# EasyEDA Pro project ProPrj_chuni_24_2026-08-18.epro

# Schematic Schematic1
Assembly Variant: Basic; Board Name: Board1; Create Date: 2026-08-10; Page Name: P1; Project Name: chuni_24; Schematic Name: Schematic1; Update Date: 2026-08-10; Company: 嘉立创EDA; Page Size: A4; Version: V1.0
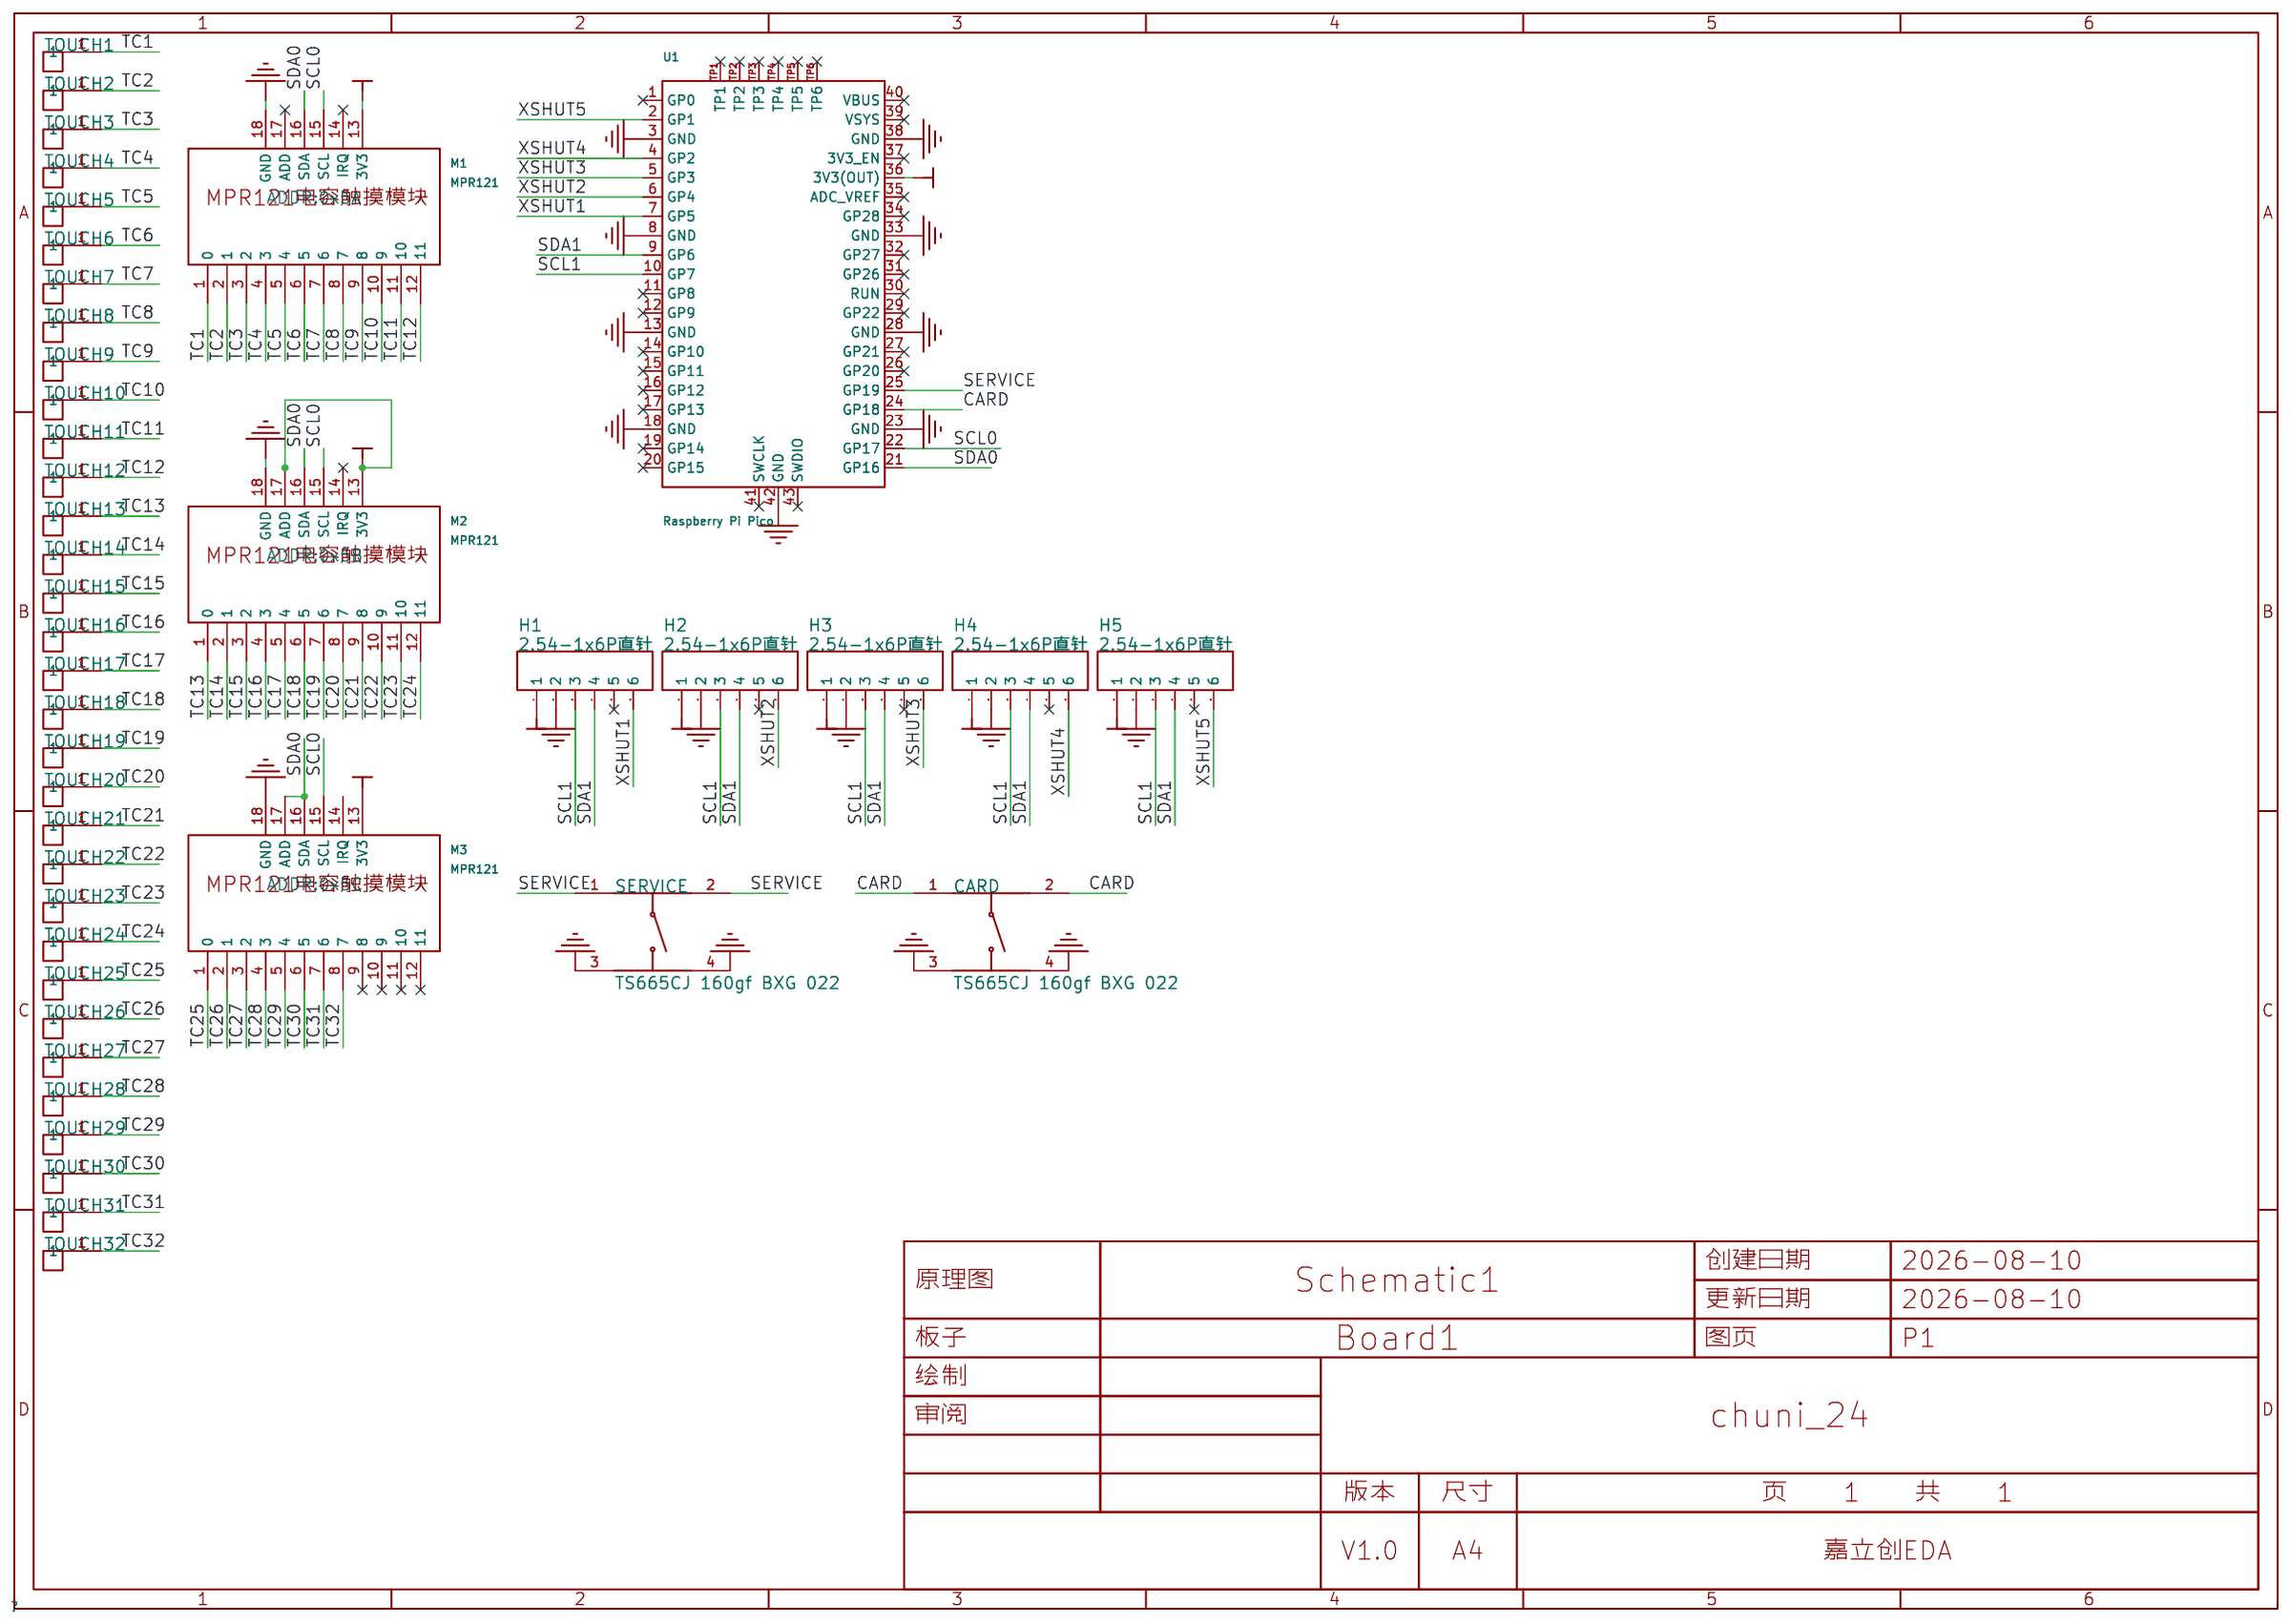
[diagram p0: schematic sheet]

## Parts
CARD  TS665CJ 160gf BXG 022  [SW-TH_4P-L6.0-W6.0-P4.50-LS6.5]
H1  2.54-1x6P直针  [HDR-TH_6P-P2.54-V-M-1]
H2  2.54-1x6P直针  [HDR-TH_6P-P2.54-V-M-1]
H3  2.54-1x6P直针  [HDR-TH_6P-P2.54-V-M-1]
H4  2.54-1x6P直针  [HDR-TH_6P-P2.54-V-M-1]
H5  2.54-1x6P直针  [HDR-TH_6P-P2.54-V-M-1]
M1  MPR121  [MPR121]
M2  MPR121  [MPR121]
M3  MPR121  [MPR121]
SERVICE  TS665CJ 160gf BXG 022  [SW-TH_4P-L6.0-W6.0-P4.50-LS6.5]
TOUCH1  -  [touch_24.5]
TOUCH2  -  [touch_24.5]
TOUCH3  -  [touch_24.5]
TOUCH4  -  [touch_24.5]
TOUCH5  -  [touch_24.5]
TOUCH6  -  [touch_24.5]
TOUCH7  -  [touch_24.5]
TOUCH8  -  [touch_24.5]
TOUCH9  -  [touch_24.5]
TOUCH10  -  [touch_24.5]
TOUCH11  -  [touch_24.5]
TOUCH12  -  [touch_24.5]
TOUCH13  -  [touch_24.5]
TOUCH14  -  [touch_24.5]
TOUCH15  -  [touch_24.5]
TOUCH16  -  [touch_24.5]
TOUCH17  -  [touch_24.5]
TOUCH18  -  [touch_24.5]
TOUCH19  -  [touch_24.5]
TOUCH20  -  [touch_24.5]
TOUCH21  -  [touch_24.5]
TOUCH22  -  [touch_24.5]
TOUCH23  -  [touch_24.5]
TOUCH24  -  [touch_24.5]
TOUCH25  -  [touch_24.5]
TOUCH26  -  [touch_24.5]
TOUCH27  -  [touch_24.5]
TOUCH28  -  [touch_24.5]
TOUCH29  -  [touch_24.5]
TOUCH30  -  [touch_24.5]
TOUCH31  -  [touch_24.5]
TOUCH32  -  [touch_24.5]
U1  Raspberry Pi Pico  [COMM-SMD_L51.0-W21.0-P2.54_SC0916]

## Library data of the parts
CARD SERVICE = TS665CJ 160gf BXG 022: 电路结构:单刀单掷;按钮形状:圆形按钮;作用力:1.6N;安装方式:直插;开关长度:6mm;开关宽度:6mm;开关高度:5mm;带支架:不带支架;触点电流:50mA;额定电压:12V;带灯:无;工作寿命:10万次;; LCSC Part Name: 四脚插件立式 6*6*5mm 不锈钢弹片 160gf; Supplier Part: C5369132; Manufacturer: SHOU HAN(首韩); Supplier Footprint: 插件-4P,6x6mm; JLCPCB Part Class: Extended Part; Datasheet: https://item.szlcsc.com/datasheet/TS665CJ%2520160gf%2520BXG%2520022/6210558.html; Supplier: LCSC; Circuit: 单刀单掷; Actuator Style: 圆形按钮; Operating Force: 1.6N; Mounting Type: 直插; Length: 6mm; Width: 6mm; Switch Height: 5mm; with Bracket: 不带支架; Contact Current: 50mA; Voltage Rating: 12V; Actuator/Cap Color: 黑色; With Lamp: 无; Termination Style: PC引脚; Life: 10万次; Operating Temperature: -16℃~+60℃
H1-H5 = 2.54-1x6P直针: 插针结构:1x6P;间距:2.54mm;行距:-;圆针/方针:方针;安装方式:直插;排数:单排;总PIN位数:6P;额定电流:3A;额定电压:-;配合针长度:6mm;塑高:2.5mm;端接针长度:3mm;触头材质:黄铜;触头镀层:金;工作温度:-40℃~+105℃;颜色:黑色;; LCSC Part Name: 1x6P 间距:2.54mm 方针 直插; Supplier Part: C37208; Manufacturer: BOOMELE(博穆精密); Supplier Footprint: 插件,P=2.54mm; JLCPCB Part Class: Extended Part; Datasheet: https://item.szlcsc.com/datasheet/2.54-1x6P%25E7%259B%25B4%25E9%2592%2588/38187.html; Supplier: LCSC; Pin Structure: 1x6P; Pitch: 2.54mm; Circluar Pins/Square Pins: 方针; Mounting Type: 直插; Number of Rows: 单排; Number of Pins: 6P; Current Rating: 3A; Length of Mating Pin: 6mm; Insulation Height: 2.5mm; Length of End Connection Pin: 3mm; Contact Material: 黄铜; Contact Plating: 金; Operating Temperature: -40℃~+105℃; Color: 黑色
M1-M3 = MPR121
TOUCH1-TOUCH32 = touch_24.5
U1 = Raspberry Pi Pico: "基于Raspberry Pi RP2040芯片设计；处理器：双核Arm Cortex-M0+ @ 133MHz内存：264KB片上SRAM；2MB板上QSPI闪存接口：26个GPIO引脚，包括3个模拟输入；2 × UART；2 × SPI控制器；2 × I2C控制器；16个PWM通道；1 × USB 1.1控制器和PHY，支持主机和设备；8 × PIO状态机"; LCSC Part Name: SC0915; Supplier Part: C7203002; Manufacturer: Raspberry Pi(树莓派); JLCPCB Part Class: Extended Part; Datasheet: https://item.szlcsc.com/datasheet/Raspberry%2520Pi%2520Pico/8170960.html; Supplier: LCSC

## Nets
GND: CARD.3(C) CARD.4(D) H1.2 H2.2 H3.2 H4.2 H5.2 M1.18(GND) M2.18(GND) M3.18(GND) SERVICE.3(C) SERVICE.4(D) U1.3(GND) U1.8(GND) U1.13(GND) U1.18(GND) U1.23(GND) U1.28(GND) U1.33(GND) U1.38(GND) U1.42(GND)
VCC: H1.1 H2.1 H3.1 H4.1 H5.1 M1.13(3V3) M2.13(3V3) M2.17(ADD) M3.13(3V3) U1.36(3V3(OUT))
CARD: CARD.1(A) CARD.2(B) U1.24(GP18)
SCL0: M1.15(SCL) M2.15(SCL) M3.15(SCL) U1.22(GP17)
SCL1: H1.3 H2.3 H3.3 H4.3 H5.3 U1.10(GP7)
SDA0: M1.16(SDA) M2.16(SDA) M3.16(SDA) M3.17(ADD) U1.21(GP16)
SDA1: H1.4 H2.4 H3.4 H4.4 H5.4 U1.9(GP6)
SERVICE: SERVICE.1(A) SERVICE.2(B) U1.25(GP19)
TC1: M1.1(0) TOUCH1.1
TC2: M1.2(1) TOUCH2.1
TC3: M1.3(2) TOUCH3.1
TC4: M1.4(3) TOUCH4.1
TC5: M1.5(4) TOUCH5.1
TC6: M1.6(5) TOUCH6.1
TC7: M1.7(6) TOUCH7.1
TC8: M1.8(7) TOUCH8.1
TC9: M1.9(8) TOUCH9.1
TC10: M1.10(9) TOUCH10.1
TC11: M1.11(10) TOUCH11.1
TC12: M1.12(11) TOUCH12.1
TC13: M2.1(0) TOUCH13.1
TC14: M2.2(1) TOUCH14.1
TC15: M2.3(2) TOUCH15.1
TC16: M2.4(3) TOUCH16.1
TC17: M2.5(4) TOUCH17.1
TC18: M2.6(5) TOUCH18.1
TC19: M2.7(6) TOUCH19.1
TC20: M2.8(7) TOUCH20.1
TC21: M2.9(8) TOUCH21.1
TC22: M2.10(9) TOUCH22.1
TC23: M2.11(10) TOUCH23.1
TC24: M2.12(11) TOUCH24.1
TC25: M3.1(0) TOUCH25.1
TC26: M3.2(1) TOUCH26.1
TC27: M3.3(2) TOUCH27.1
TC28: M3.4(3) TOUCH28.1
TC29: M3.5(4) TOUCH29.1
TC30: M3.6(5) TOUCH30.1
TC31: M3.7(6) TOUCH31.1
TC32: M3.8(7) TOUCH32.1
XSHUT1: H1.6 U1.7(GP5)
XSHUT2: H2.6 U1.6(GP4)
XSHUT3: H3.6 U1.5(GP3)
XSHUT4: H4.6 U1.4(GP2)
XSHUT5: H5.6 U1.2(GP1)

Not connected (* = marked no-connect by the designer): H1 5*; H2 5*; H3 5*; H4 5*; H5 5*; M1 14(IRQ)* 17(ADD)*; M2 14(IRQ)*; M3 9(8)* 10(9)* 11(10)* 12(11)* 14(IRQ); U1 1(GP0)* 11(GP8)* 12(GP9)* 14(GP10)* 15(GP11)* 16(GP12)* 17(GP13)* 19(GP14)* 20(GP15)* 26(GP20)* 27(GP21)* 29(GP22)* 30(RUN)* 31(GP26)* 32(GP27)* 34(GP28)* 35(ADC_VREF)* 37(3V3_EN)* 39(VSYS)* 40(VBUS)* 41(SWCLK)* 43(SWDIO)* TP1* TP2* TP3* TP4* TP5* TP6*

## Notes on the sheet
- ADDR:0x5A
- ADDR:0x5B
- ADDR:0x5C

# Board PCB1
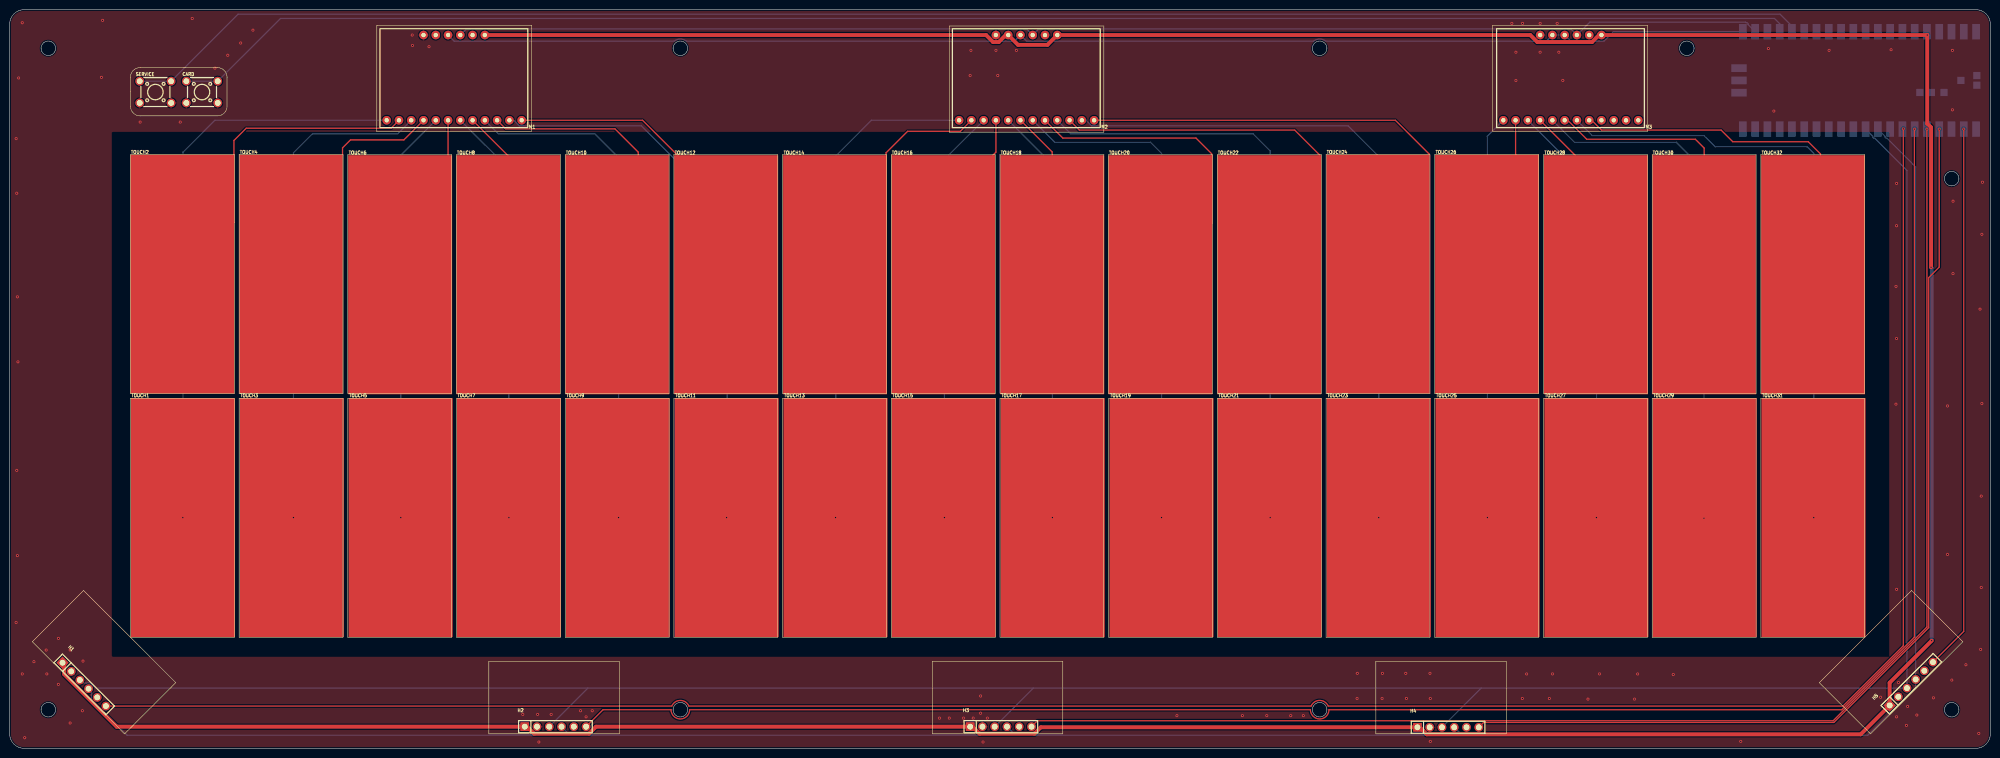
[diagram p1: board, top side]
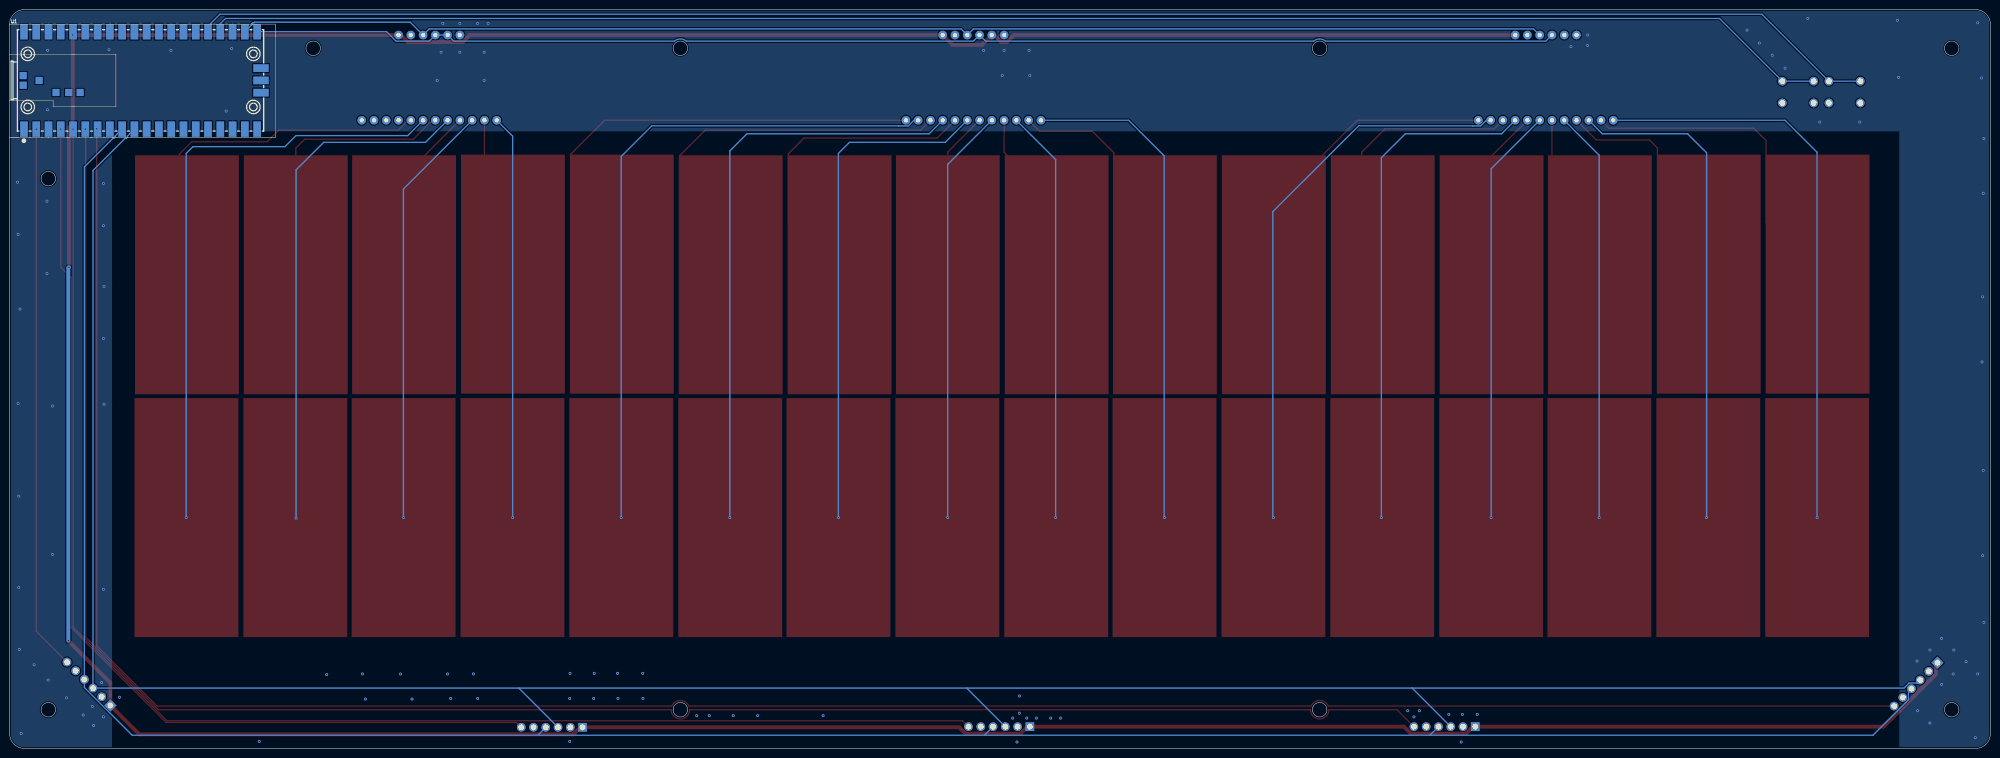
[diagram p2: board, bottom side, seen from below]

Outline 410 x 153 mm; copper layers: Top Layer, Bottom Layer. Coordinates in mm from the lower left corner of the outline.
Outline path: 0,150 arc(0.88,152.12) 3,153 407,153 arc(409.12,152.12) 410,150 410,3 arc(409.12,0.88) 407,0 3,0 arc(0.88,0.88) 0,3 0,150 ; 6.5,145 arc(8,146.5) 9.5,145 arc(8,143.5) 6.5,145 ; 6.5,8 arc(8,9.5) 9.5,8 arc(8,6.5) 6.5,8 ; 137.33,145 arc(138.83,146.5) 140.33,145 arc(138.83,143.5) 137.33,145 ; 137.33,8 arc(138.83,9.5) 140.33,8 arc(138.83,6.5) 137.33,8 ; 269.67,145 arc(271.17,146.5) 272.67,145 arc(271.17,143.5) 269.67,145 ; 269.67,8 arc(271.17,9.5) 272.67,8 arc(271.17,6.5) 269.67,8 ; 345.67,145 arc(347.17,146.5) 348.67,145 arc(347.17,143.5) 345.67,145 ; 400.5,118 arc(402,119.5) 403.5,118 arc(402,116.5) 400.5,118 ; 400.5,8 arc(402,9.5) 403.5,8 arc(402,6.5) 400.5,8
Stack: Top Layer 0.035mm / Dielectric1 1.51mm FR4 er 4.5 / Bottom Layer 0.035mm

## Design rules (mm)
spacing copperThickness1oz (default): track to track 0.102, other pairs 0.152 to 0.3
spacing copperThickness2oz: track to track 0.203, other pairs 0.152 to 0.3
track width copperThickness1oz (default): min 0.127, default 0.254, max 2.54
track width copperThickness2oz: min 0.203, default 0.254, max 2.54
differential pair differentialPair (default): width min 0.127, default 0.254, max 2.54; gap min 0.152, default 0.152
net GND uses copperRegion

## Placement (name value [footprint] x y rotation side)
CARD  TS665CJ 160gf BXG 022  [SW-TH_4P-L6.0-W6.0-P4.50-LS6.5]  39.82 135.93 0 top
H1  2.54-1x6P直针  [HDR-TH_6P-P2.54-V-M-1]  15.43 13.25 315 top
H2  2.54-1x6P直针  [HDR-TH_6P-P2.54-V-M-1]  112.97 4.49 0 top
H3  2.54-1x6P直针  [HDR-TH_6P-P2.54-V-M-1]  205.17 4.49 0 top
H4  2.54-1x6P直针  [HDR-TH_6P-P2.54-V-M-1]  297.76 4.36 0 top
H5  2.54-1x6P直针  [HDR-TH_6P-P2.54-V-M-1]  393.64 13.38 45 top
M1  -  [MPR121]  92.02 137.33 180 top
M2  -  [MPR121]  210.51 137.33 180 top
M3  -  [MPR121]  323.16 137.33 180 top
SERVICE  TS665CJ 160gf BXG 022  [SW-TH_4P-L6.0-W6.0-P4.50-LS6.5]  30.17 135.93 0 top
TOUCH1  -  [touch_24.5]  35.85 47.8 0 top
TOUCH2  -  [touch_24.5]  35.75 98.22 0 top
TOUCH3  -  [touch_24.5]  58.38 47.8 0 top
TOUCH4  -  [touch_24.5]  58.28 98.22 0 top
TOUCH5  -  [touch_24.5]  80.93 47.8 0 top
TOUCH6  -  [touch_24.5]  80.83 98.09 0 top
TOUCH7  -  [touch_24.5]  103.34 47.8 0 top
TOUCH8  -  [touch_24.5]  103.24 98.09 0 top
TOUCH9  -  [touch_24.5]  125.88 47.8 0 top
TOUCH10  -  [touch_24.5]  125.78 98.09 0 top
TOUCH11  -  [touch_24.5]  148.41 47.8 0 top
TOUCH12  -  [touch_24.5]  148.32 98.09 0 top
TOUCH13  -  [touch_24.5]  170.95 47.8 0 top
TOUCH14  -  [touch_24.5]  170.85 98.09 0 top
TOUCH15  -  [touch_24.5]  193.36 47.8 0 top
TOUCH16  -  [touch_24.5]  193.26 98.09 0 top
TOUCH17  -  [touch_24.5]  215.9 47.8 0 top
TOUCH18  -  [touch_24.5]  215.8 98.09 0 top
TOUCH19  -  [touch_24.5]  238.44 47.8 0 top
TOUCH20  -  [touch_24.5]  238.21 98.09 0 top
TOUCH21  -  [touch_24.5]  260.85 47.8 0 top
TOUCH22  -  [touch_24.5]  260.75 98.09 0 top
TOUCH23  -  [touch_24.5]  283.38 47.8 0 top
TOUCH24  -  [touch_24.5]  283.29 98.22 0 top
TOUCH25  -  [touch_24.5]  305.92 47.8 0 top
TOUCH26  -  [touch_24.5]  305.82 98.22 0 top
TOUCH27  -  [touch_24.5]  328.46 47.8 0 top
TOUCH28  -  [touch_24.5]  328.36 98.09 0 top
TOUCH29  -  [touch_24.5]  350.87 47.8 0 top
TOUCH30  -  [touch_24.5]  350.77 98.09 0 top
TOUCH31  -  [touch_24.5]  373.4 47.8 0 top
TOUCH32  -  [touch_24.5]  373.31 98.09 0 top
U1  Raspberry Pi Pico  [COMM-SMD_L51.0-W21.0-P2.54_SC0916]  382.59 138.34 180 bottom

## Footprints (pads in the part's own frame, mm; a bottom-side part is the same pattern mirrored in y, then rotated)
COMM-SMD_L51.0-W21.0-P2.54_SC0916
  rect 1.6x3.2 smd: 1(-24.445,-10.088) 2(-21.905,-10.088) 3(-19.365,-10.088) 4(-16.825,-10.088) 5(-14.285,-10.088) 6(-11.745,-10.088) 7(-9.205,-10.088) 8(-6.665,-10.088) 9(-4.125,-10.088) 10(-1.585,-10.088) 11(0.955,-10.088) 12(3.495,-10.088) 13(6.035,-10.088) 14(8.575,-10.088) 15(11.115,-10.088) 16(13.655,-10.088) 17(16.195,-10.088) 18(18.735,-10.088) 19(21.275,-10.088) 20(23.815,-10.088) 21(23.815,10.088) 22(21.275,10.088) 23(18.735,10.088) 24(16.195,10.088) 25(13.655,10.088) 26(11.115,10.088) 27(8.575,10.088) 28(6.035,10.088) 29(3.495,10.088) 30(0.955,10.088) 31(-1.585,10.088) 32(-4.125,10.088) 33(-6.665,10.088) 34(-9.205,10.088) 35(-11.745,10.088) 36(-14.285,10.088) 37(-16.825,10.088) 38(-19.365,10.088) 39(-21.905,10.088) 40(-24.445,10.088)
  rect 3.2x1.6 smd: 41(24.615,-2.54) 42(24.615,0) 43(24.615,2.54)
  rect 1.5x1.5 smd: TP1(-21.315,0) TP2(-24.615,1) TP3(-24.615,-1) TP4(-17.815,-2.5) TP5(-15.188,-2.5) TP6(-12.815,-2.5)
HDR-TH_6P-P2.54-V-M-1
  rect 1.8x1.8 hole 1.2: 1(-6.35,0)
  round 1.8 hole 1.2: 2(-3.81,0) 3(-1.27,0) 4(1.27,0) 5(3.81,0) 6(6.35,0)
MPR121
  oval 1.778x1.778 hole 0.889: 1(13.97,7.239) 2(11.43,7.239) 3(8.89,7.239) 4(6.35,7.239) 5(3.81,7.239) 6(1.27,7.239) 7(-1.27,7.239) 8(-3.81,7.239) 9(-6.35,7.239) 10(-8.89,7.239) 11(-11.43,7.239) 12(-13.97,7.239) 13(-6.35,-10.414) 14(-3.81,-10.414) 15(-1.27,-10.414) 16(1.27,-10.414) 17(3.81,-10.414) 18(6.35,-10.414)
SW-TH_4P-L6.0-W6.0-P4.50-LS6.5
  round 1.8 hole 1.2: 1(-3.25,2.25) 2(3.25,2.25) 3(-3.25,-2.25) 4(3.25,-2.25)
touch_24.5
  rect 21.5x49.5 smd: 1(0,0)

## Nets
As in the schematic.

Pads without a net: H1 5; H2 5; H3 5; H4 5; H5 5; M1 14 17; M2 14; M3 9 10 11 12 14; U1 1 11 12 14 15 16 17 19 20 26 27 29 30 31 32 34 35 37 39 40 41 43 TP1 TP2 TP3 TP4 TP5 TP6

## Via types
v1: diameter 0.61, hole 0.305, Top Layer to Bottom Layer, 142 vias

## Routing (per net, layer and track width the routed paths; a pad name or vN(x,y) marks a point on that pad's centre or on a via; arc(x,y) is an arc through that point)
GND:
  vias: v1(1.34,126.28) v1(1.34,26.08) v1(1.46,114.98) v1(1.46,57.57) v1(1.59,93.51) v1(1.59,39.92) v1(1.72,80.05) v1(1.85,138.85) v1(2.61,150.28) v1(2.61,15.41) v1(3.12,2.2) v1(5.02,17.95) v1(7.56,20.36) v1(7.69,15.41) v1(10.1,22.78) v1(10.08,13.25) v1(12.51,20.36) v1(12.51,5.25) v1(15.05,7.79) v1(15.18,18.08) v1(18.99,138.98) v1(19.24,150.79) v1(27.01,129.71) v1(35.31,129.71) v1(37.79,151.17) v1(42.49,140.89) v1(45.15,143.55) v1(47.82,146.09) v1(50.36,148.76) v1(83.33,147.74) v1(83.38,145.58) v1(86.81,145.33) v1(106.22,7.03) v1(109.29,7.03) v1(109.54,1.31) v1(112.09,7.03) v1(118.18,7.79) v1(119.32,6.52) v1(120.59,7.79) v1(192.48,6.27) v1(194.5,6.27) v1(197.46,6.27) v1(198.82,139.36) v1(198.98,144.57) v1(199.46,6.27) v1(200.98,10.84) v1(200.98,7.28) v1(201.49,1.31) v1(202.38,6.27) v1(204.16,144.57) v1(204.54,139.36) v1(208.38,144.57) v1(241.62,6.77) v1(255.17,6.77) v1(260.23,6.77) v1(265.18,6.77) v1(267.78,6.77) v1(278.96,15.54) v1(278.91,10.33) v1(284.17,15.54) v1(284.08,10.33) v1(288.99,15.54) v1(289.12,10.33) v1(294,15.54) v1(294.07,10.33) v1(294.07,1.44) v1(310.96,150.16) v1(311.79,144.19) v1(311.79,138.34) v1(313.17,150.16) v1(313.12,10.33) v1(314.01,15.41) v1(316.81,150.16) v1(316.81,144.19) v1(318.71,10.33) v1(319.36,15.41) v1(320.33,150.16) v1(320.68,144.19) v1(321.5,138.34) v1(326.71,10.2) v1(329.11,15.41) v1(336.36,10.2) v1(336.99,15.41) v1(344.36,15.28) v1(358.33,1.44) v1(364.05,144.95) v1(365.19,132) v1(376.62,144.57) v1(387.29,10.58) v1(389.45,144.69) v1(390.47,95.67) v1(390.47,71.29) v1(390.59,117.01) v1(390.59,108.25) v1(390.59,84.88) v1(390.59,32.94) v1(390.59,6.52) v1(390.97,13.63) v1(392.62,4.74) v1(392.88,8.68) v1(394.78,6.9) v1(398.21,10.46) v1(401.13,70.91) v1(401.13,40.17) v1(402.02,14.14) v1(402.15,144.57) v1(402.15,132.25) v1(402.28,113.33) v1(402.28,98.34) v1(404.94,17.31) v1(407.61,3.09) v1(407.86,90.97) v1(407.99,20.49) v1(408.12,52.24) v1(408.12,33.32) v1(408.25,106.47) v1(408.25,71.42) v1(408.37,117.26)
VCC: length 835.8
  Top Layer w0.8: H1.1 11.29,17.4 11.29,15.34 22.14,4.49 H2.1 107.11,4.49 108.56,3.03 119.92,3.03 121.37,4.49 H3.1 198.95,4.36 199.44,4.36 200.76,3.03 212.12,3.03 213.45,4.36 H4.1 291.89,4.36 293.34,2.91 383.17,2.91 H5.1 389.15,13.59 v1(397.86,22.3) ; v1(397.73,99.64) 397.73,128.61 396.94,129.4 v1(396.94,147.74) M3.13 329,147.74 327.56,146.3 316.21,146.3 314.77,147.74 M2.13 214.82,145.71 208.73,145.71 M2.17 206.19,147.74 204.75,146.3 203.56,146.3 202.12,147.74 M1.13
  Bottom Layer w0.8: v1(397.73,99.64) 397.86,99.51 v1(397.86,22.3)
CARD: length 337.3
  Bottom Layer w0.254: CARD.1 CARD.2 56.06,151.17 365.32,151.17 366.4,150.09 U1.24
SCL0: length 272.2
  Bottom Layer w0.254: M1.15 94.56,149.01 210.51,149.01 M2.15 213.05,149.01 323.16,149.01 324.43,147.74 327.09,150.41 359.34,150.41 359.44,150.31 359.58,150.31 arc(359.77,150.23) 359.86,150.03 359.86,149.89 U1.22
SCL1: length 532.4
  Bottom Layer w0.254: 304.6,12.48 H5.3 392.74,119.69 386.06,126.38 385.92,126.38 arc(385.72,126.46) 385.64,126.66 385.64,126.8 U1.10 ; 304.6,12.48 211.89,12.48 ; 304.6,12.48 H4.3 ; H1.3 15.15,13.53 16.82,13.53 17.87,12.48 119.69,12.48 ; 211.89,12.48 H3.3 ; 211.89,12.48 119.69,12.48 ; 119.69,12.48 H2.3
SDA0: length 271.9
  Bottom Layer w0.254: 90.75,147.74 92.02,146.47 137.59,146.47 arc(138.83,146.93) 140.07,146.47 207.97,146.47 M2.16 210.51,146.47 269.93,146.47 arc(271.17,146.93) 272.41,146.47 318.08,146.47 M3.17 M3.16 323.16,146.47 330.01,146.47 331.97,148.43 U1.21
SDA1: length 513.7
  Bottom Layer w0.254: U1.9 388.18,126.8 388.18,126.66 arc(388.26,126.46) 388.46,126.38 388.6,126.38 394.54,120.44 H5.4 394.54,12.61 389.35,7.42 arc(389.32,7.39) 389.28,7.37 384.62,2.71 300.68,2.71 ; 208.22,2.71 116.02,2.71 ; 208.22,2.71 H3.4 ; 208.22,2.71 300.68,2.71 ; 116.02,2.71 H2.4 ; 116.02,2.71 24.31,2.71 16.95,10.07 16.95,11.74 16.33,12.35 ; 300.68,2.71 H4.4
SERVICE: length 349.9
  Bottom Layer w0.254: U1.25 368.94,149.59 366.46,152.06 47.3,152.06 SERVICE.2 SERVICE.1
TC1: length 120.6
  Bottom Layer w0.254: 35.88,47.79 35.88,123.49 42.49,130.09 M1.1
  vias: v1(35.85,47.8)
TC2: length 68
  Top Layer w0.254: TOUCH2.1 46.42,108.89 46.42,125.9 48.96,128.44 78.93,128.44 M1.2
TC3: length 102.7
  Bottom Layer w0.254: 83.13,130.09 80.33,127.3 62.68,127.3 58.74,123.36 v1(58.74,47.79)
TC4: length 49.7
  Top Layer w0.254: TOUCH4.1 58.28,112.23 68.9,122.85 68.9,124.38 70.55,126.03 81.6,126.03 85.67,130.09
TC5: length 85.3
  Bottom Layer w0.254: v1(80.97,47.79) 80.97,122.85 88.21,130.09
TC6: length 36.1
  Top Layer w0.254: 90.75,130.09 90.75,108 TOUCH6.1
TC7: length 86.5
  Bottom Layer w0.254: M1.7 103.32,120.06 103.32,47.79
  vias: v1(103.34,47.8)
TC8: length 35.1
  Top Layer w0.254: TOUCH8.1 103.24,122.67 M1.8
TC9: length 105.4
  Bottom Layer w0.254: v1(126.05,47.79) 126.05,122.34 121.1,127.3 101.16,127.3 M1.9
TC10: length 59.1
  Top Layer w0.254: M1.10 102.68,128.31 125.29,128.31 130.12,123.49 130.12,102.42 TOUCH10.1
TC11: length 116.2
  Bottom Layer w0.254: 148.53,47.92 148.53,111.17 130.75,128.95 107.21,128.95 107.18,128.92 105.5,128.92 104.33,130.09 M1.11
  vias: v1(148.41,47.8)
TC12: length 64.2
  Top Layer w0.254: M1.12 131,130.09 148.32,112.78 TOUCH12.1
TC13: length 103.4
  Bottom Layer w0.254: M2.1 178.38,130.09 171.01,122.72 171.01,47.92
  vias: v1(170.95,47.8)
TC14: length 50.1
  Top Layer w0.254: TOUCH14.1 181.42,108.66 181.42,123.36 185.87,127.8 196.79,127.8 M2.2
TC15: length 85.7
  Bottom Layer w0.254: M2.3 193.49,121.96 v1(193.49,47.79)
TC16: length 36.5
  Top Layer w0.254: TOUCH16.1 193.26,112.59 204.16,123.49 M2.4
TC17: length 86.1
  Bottom Layer w0.254: M2.5 215.84,120.95 v1(215.84,47.79)
TC18: length 34.7
  Top Layer w0.254: M2.6 215.8,123.53 TOUCH18.1
TC19: length 104.9
  Bottom Layer w0.254: M2.7 216.35,125.52 236.16,125.52 238.45,123.23 238.45,47.79
  vias: v1(238.44,47.8)
TC20: length 66.8
  Top Layer w0.254: M2.8 218,126.41 245.56,126.41 248.8,123.17 248.8,108.68 TOUCH20.1
TC21: length 122.6
  Bottom Layer w0.254: v1(260.93,47.79) 260.93,123.74 257.37,127.3 219.65,127.3 M2.9
TC22: length 83.9
  Top Layer w0.254: TOUCH22.1 271.21,108.55 271.21,122.85 266.01,128.06 221.43,128.06 M2.10
TC23: length 139.4
  Bottom Layer w0.254: v1(283.4,47.79) 283.4,122.6 277.05,128.95 226,128.95 225.98,128.92 223.99,128.92 222.82,130.09 M2.11
TC24: length 101.5
  Top Layer w0.254: M2.12 286.83,130.09 293.82,123.11 293.82,108.75 TOUCH24.1
TC25: length 83.7
  Bottom Layer w0.254: v1(305.88,47.79) 305.88,126.79 309.19,130.09
TC26: length 34.3
  Top Layer w0.254: 311.73,130.09 311.73,104.12 TOUCH26.1
TC27: length 88.2
  Bottom Layer w0.254: M3.3 328.49,115.87 328.49,47.79
  vias: v1(328.46,47.8)
TC28: length 36.8
  Top Layer w0.254: 316.81,130.09 328.36,118.54 TOUCH28.1
TC29: length 107.8
  Bottom Layer w0.254: M3.5 323.92,125.52 345,125.52 350.71,119.8 v1(350.71,47.67)
TC30: length 57.5
  Top Layer w0.254: TOUCH30.1 350.77,124.32 348.94,126.15 326.46,126.15 322.52,130.09 M3.6
TC31: length 127.3
  Bottom Layer w0.254: v1(373.45,47.79) 373.45,123.23 372.05,124.63 353,124.63 350.71,126.92 327.6,126.92 324.43,130.09
TC32: length 76.4
  Top Layer w0.254: M3.8 327.47,130.09 329.51,128.06 354.27,128.06 356.68,125.65 372.3,125.65 374.84,123.11 374.84,99.63 TOUCH32.1
XSHUT1: length 486.2
  Top Layer w0.254: 19.92,8.76 137.06,8.76 arc(138.83,9.93) 140.6,8.76 269.4,8.76 arc(271.17,9.93) 272.94,8.76 379.5,8.76 391.99,21.25 v1(391.99,128.31)
XSHUT2: length 392.3
  Top Layer w0.254: H2.6 122.83,8 136.9,8 arc(138.83,6.07) 140.76,8 269.24,8 arc(271.17,6.07) 273.1,8 379.24,8 394.28,23.03 394.28,128.31
  vias: v1(394.34,128.26)
XSHUT3: length 297
  Top Layer w0.254: v1(396.88,128.26) 396.88,25.13 377.46,5.72 212.75,5.72 H3.6
XSHUT4: length 205.8
  Top Layer w0.254: H4.6 305.11,5.36 377.61,5.36 397.23,24.98 397.23,97.49 399.42,99.67 v1(399.42,128.26)
XSHUT5: length 113
  Top Layer w0.254: v1(404.5,128.26) 404.5,24.23 H5.6

## Copper pours and planes (outline as drawn; the poured copper is in the pictures)
GND on Top Layer: -3.23,157.01 413.58,157.01 413.58,-4.02 -3.23,-4.02
GND on Bottom Layer: 388.81,162.48 417.26,162.48 417.26,-14.18 388.81,-14.18
GND on Bottom Layer: -5.52,159.17 18.86,159.17 18.86,-24.85 -5.52,-24.85
GND on Bottom Layer: -7.93,164.51 418.15,164.51 418.15,-11.64 -7.93,-11.64
GND on Bottom Layer: -8.95,18.08 432.25,18.08 432.25,-10.88 -8.95,-10.88
GND on Bottom Layer: -5.52,160.57 414.6,160.57 414.6,127.8 -5.52,127.8
(no net) on Top Layer: 21.4,127.42 388.81,127.42 388.81,19.22 21.4,19.22
